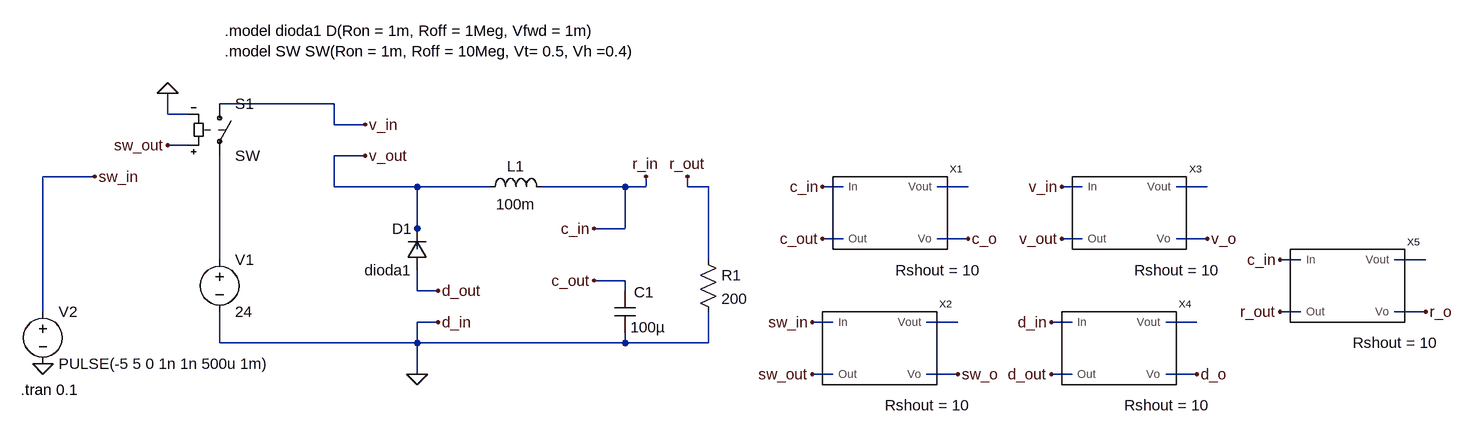
[diagram p0: schematic current_meas_buck_conv_test.asc]
current_meas_buck_conv_test.asc, the LTspice schematic file:
Version 4
SHEET 1 880 680
WIRE -1040 -480 -1216 -480
WIRE -1296 -464 -1296 -496
WIRE -1264 -464 -1296 -464
WIRE -1040 -448 -1040 -480
WIRE -992 -448 -1040 -448
WIRE -1264 -416 -1296 -416
WIRE -992 -400 -1040 -400
WIRE -1408 -368 -1488 -368
WIRE -1040 -352 -1040 -400
WIRE -912 -352 -1040 -352
WIRE -800 -352 -912 -352
WIRE -592 -352 -720 -352
WIRE -560 -352 -560 -368
WIRE -560 -352 -592 -352
WIRE -496 -352 -496 -368
WIRE -464 -352 -496 -352
WIRE -256 -352 -288 -352
WIRE -64 -352 -112 -352
WIRE 112 -352 80 -352
WIRE 304 -352 256 -352
WIRE -912 -288 -912 -352
WIRE -592 -288 -592 -352
WIRE -592 -288 -640 -288
WIRE -256 -272 -288 -272
WIRE -64 -272 -112 -272
WIRE 112 -272 80 -272
WIRE 304 -272 256 -272
WIRE -912 -256 -912 -288
WIRE -1216 -240 -1216 -400
WIRE -464 -240 -464 -352
WIRE 448 -240 416 -240
WIRE 640 -240 592 -240
WIRE -592 -208 -640 -208
WIRE -912 -192 -912 -224
WIRE -880 -192 -912 -192
WIRE -592 -192 -592 -208
WIRE -1488 -160 -1488 -368
WIRE 448 -160 416 -160
WIRE 640 -160 592 -160
WIRE -880 -144 -912 -144
WIRE -272 -144 -304 -144
WIRE -80 -144 -128 -144
WIRE 96 -144 64 -144
WIRE 288 -144 240 -144
WIRE -1216 -112 -1216 -160
WIRE -912 -112 -912 -144
WIRE -912 -112 -1216 -112
WIRE -592 -112 -592 -128
WIRE -592 -112 -912 -112
WIRE -464 -112 -464 -160
WIRE -464 -112 -592 -112
WIRE -912 -64 -912 -112
WIRE -272 -64 -304 -64
WIRE -80 -64 -128 -64
WIRE 96 -64 64 -64
WIRE 288 -64 240 -64
FLAG -912 -64 0
FLAG -1296 -496 0
FLAG -1488 -80 0
FLAG -640 -288 c_in
FLAG -640 -208 c_out
FLAG -288 -352 c_in
FLAG -288 -272 c_out
FLAG -64 -272 c_o
FLAG -1408 -368 sw_in
FLAG -1296 -416 sw_out
FLAG -992 -448 v_in
FLAG -992 -400 v_out
FLAG -880 -144 d_in
FLAG -880 -192 d_out
FLAG -496 -368 r_out
FLAG 304 -272 v_o
FLAG 288 -64 d_o
FLAG 416 -240 c_in
FLAG 640 -160 r_o
FLAG -304 -144 sw_in
FLAG -304 -64 sw_out
FLAG 80 -352 v_in
FLAG 80 -272 v_out
FLAG 64 -64 d_out
FLAG 64 -144 d_in
FLAG 416 -160 r_out
FLAG -560 -368 r_in
FLAG -80 -64 sw_o
SYMBOL cap -608 -192 R0
WINDOW 0 30 2 Left 2
SYMATTR InstName C1
SYMATTR Value 100µ
SYMBOL res -480 -256 R0
SYMATTR InstName R1
SYMATTR Value 200
SYMBOL ind -816 -336 R270
WINDOW 0 32 56 VTop 2
WINDOW 3 5 56 VBottom 2
SYMATTR InstName L1
SYMATTR Value 100m
SYMBOL diode -896 -224 R180
WINDOW 0 24 64 Left 2
WINDOW 3 24 0 Left 2
SYMATTR InstName D1
SYMATTR Value dioda1
SYMBOL voltage -1216 -256 R0
WINDOW 123 0 0 Left 2
WINDOW 39 0 0 Left 2
SYMATTR InstName V1
SYMATTR Value 24
SYMBOL sw -1216 -496 R0
SYMATTR InstName S1
SYMBOL voltage -1488 -176 R0
WINDOW 123 0 0 Left 2
WINDOW 39 0 0 Left 2
SYMATTR InstName V2
SYMATTR Value PULSE(-5 5 0 1n 1n 500u 1m)
SYMBOL CuMeas -176 -224 R0
WINDOW 39 0 0 Left 2
SYMATTR InstName X1
SYMATTR SpiceLine Rshout = 10
SYMBOL CuMeas -192 -16 R0
WINDOW 39 0 0 Left 2
SYMATTR InstName X2
SYMATTR SpiceLine Rshout = 10
SYMBOL CuMeas 192 -224 R0
WINDOW 39 0 0 Left 2
SYMATTR InstName X3
SYMATTR SpiceLine Rshout = 10
SYMBOL CuMeas 176 -16 R0
WINDOW 39 0 0 Left 2
SYMATTR InstName X4
SYMATTR SpiceLine Rshout = 10
SYMBOL CuMeas 528 -112 R0
WINDOW 39 0 0 Left 2
SYMATTR InstName X5
SYMATTR SpiceLine Rshout = 10
TEXT -1208 -592 Left 2 !.model dioda1 D(Ron = 1m, Roff = 1Meg, Vfwd = 1m)\n.model SW SW(Ron = 1m, Roff = 10Meg, Vt= 0.5, Vh =0.4)
TEXT -1522 -40 Left 2 !.tran 0.1

The netlist it stands for:
* current_meas_buck_conv_test.asc
C1 c_out 0 100µ
R1 r_out 0 200
L1 v_out r_in 100m
D1 d_out v_out dioda1
V1 N003 0 24
S1 v_in N003 sw_out 0 SW
V2 sw_in 0 PULSE(-5 5 0 1n 1n 500u 1m)
XX1 r_in c_out N001 c_o CuMeas Rshout = 10  ; pins In Out Vout Vo
XX2 sw_in sw_out N005 sw_o CuMeas Rshout = 10  ; pins In Out Vout Vo
XX3 v_in v_out N002 v_o CuMeas Rshout = 10  ; pins In Out Vout Vo
XX4 0 d_out N006 d_o CuMeas Rshout = 10  ; pins In Out Vout Vo
XX5 r_in r_out N004 r_o CuMeas Rshout = 10  ; pins In Out Vout Vo
.model D D
.lib standard.dio
.model dioda1 D(Ron = 1m, Roff = 1Meg, Vfwd = 1m)
.model SW SW(Ron = 1m, Roff = 10Meg, Vt= 0.5, Vh =0.4)
.tran 0.1
.backanno
.end